# Altium schematic sheet [07] - ETHERNET CONTROLLER.SchDoc
size A3; SheetNumber: 8; SheetTotal: 10
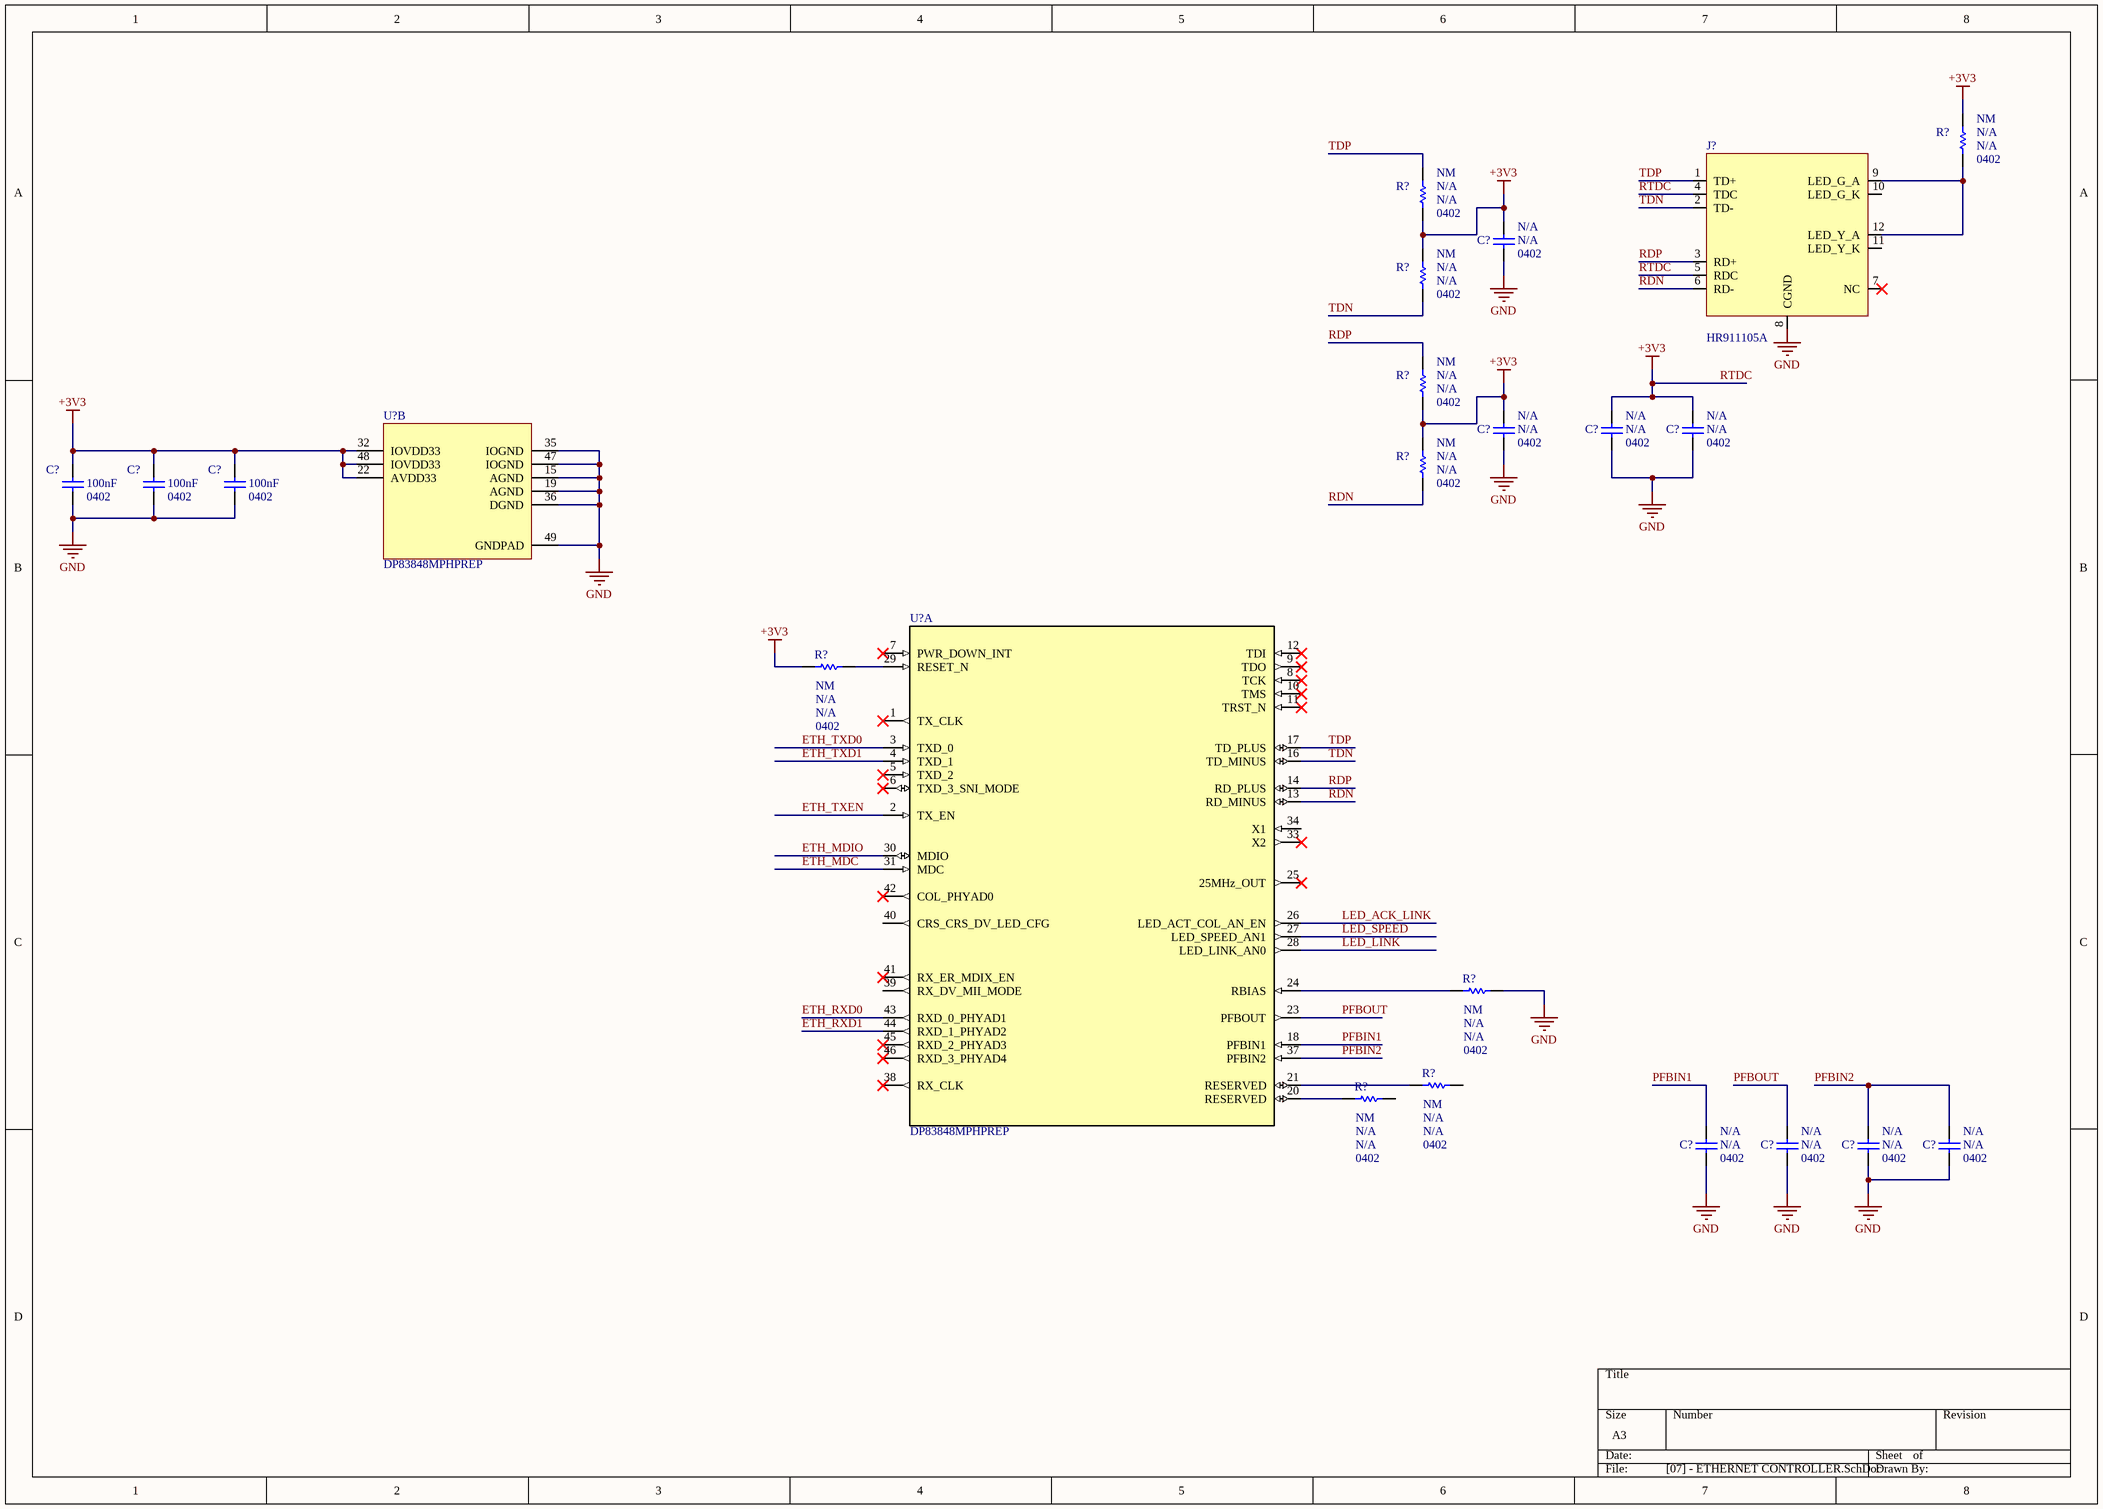
[diagram p0: [07] - ETHERNET CONTROLLER.SchDoc]

## Parts
(Parts that share a designator on the sheet are numbered #1, #2 ... from top to bottom, then left to right.)
C?#1  Package / Case: 0402  [CAP_0402]  (hidden comment: CAP 0402)
C?#2  Package / Case: 0402  [CAP_0402]  (hidden comment: CAP 0402)
C?#3  Package / Case: 0402  [CAP_0402]  (hidden comment: CAP 0402)
C?#4  Package / Case: 0402  [CAP_0402]  (hidden comment: CAP 0402)
C?#5  Package / Case: 0402  Capacitance: 100nF  [CAP_0402]  (hidden comment: CAP 0402)
C?#6  Package / Case: 0402  Capacitance: 100nF  [CAP_0402]  (hidden comment: CAP 0402)
C?#7  Package / Case: 0402  Capacitance: 100nF  [CAP_0402]  (hidden comment: CAP 0402)
C?#8  Package / Case: 0402  [CAP_0402]  (hidden comment: CAP 0402)
C?#9  Package / Case: 0402  [CAP_0402]  (hidden comment: CAP 0402)
C?#10  Package / Case: 0402  [CAP_0402]  (hidden comment: CAP 0402)
C?#11  Package / Case: 0402  [CAP_0402]  (hidden comment: CAP 0402)
J?  HR911105A  [CONN_RJ45_HANRUN_HR911105A]
R?#1  Package / Case: 0402  Resistance: NM  [RES_0402]  (hidden comment: RES 0402)
R?#2  Package / Case: 0402  Resistance: NM  [RES_0402]  (hidden comment: RES 0402)
R?#3  Package / Case: 0402  Resistance: NM  [RES_0402]  (hidden comment: RES 0402)
R?#4  Package / Case: 0402  Resistance: NM  [RES_0402]  (hidden comment: RES 0402)
R?#5  Package / Case: 0402  Resistance: NM  [RES_0402]  (hidden comment: RES 0402)
R?#6  Package / Case: 0402  Resistance: NM  [RES_0402]  (hidden comment: RES 0402)
R?#7  Package / Case: 0402  Resistance: NM  [RES_0402]  (hidden comment: RES 0402)
R?#8  Package / Case: 0402  Resistance: NM  [RES_0402]  (hidden comment: RES 0402)
R?#9  Package / Case: 0402  Resistance: NM  [RES_0402]  (hidden comment: RES 0402)
U?#1  DP83848MPHPREP  [TI_PHY_DP83848-EP]  (part B of 2)
U?#2  DP83848MPHPREP  [TI_PHY_DP83848-EP]  (part A of 2)

## Nets
GND: C?#1.1 C?#2.1 C?#3.1 C?#4.1 C?#5.1 C?#6.1 C?#7.1 C?#8.1 C?#9.1 C?#10.1 C?#11.1 J?.8(CGND) R?#7.1 U?#1.15(AGND) U?#1.19(AGND) U?#1.35(IOGND) U?#1.36(DGND) U?#1.47(IOGND) U?#1.49(GNDPAD)
RTDC: C?#1.2 C?#2.2 C?#3.2 C?#4.2 C?#5.2 C?#6.2 C?#7.2 J?.4(TDC) J?.5(RDC) R?#1.2 R?#2.1 R?#3.2 R?#4.1 R?#5.2 R?#6.2 U?#1.22(AVDD33) U?#1.32(IOVDD33) U?#1.48(IOVDD33)  [also labelled +3V3]
ETH_MDC: U?#2.31(MDC)
ETH_MDIO: U?#2.30(MDIO)
ETH_RXD0: U?#2.43(RXD_0_PHYAD1)
ETH_RXD1: U?#2.44(RXD_1_PHYAD2)
ETH_TXD0: U?#2.3(TXD_0)
ETH_TXD1: U?#2.4(TXD_1)
ETH_TXEN: U?#2.2(TX_EN)
LED_ACK_LINK: U?#2.26(LED_ACT_COL_AN_EN)
LED_LINK: U?#2.28(LED_LINK_AN0)
LED_SPEED: U?#2.27(LED_SPEED_AN1)
PFBIN1: C?#8.2 U?#2.18(PFBIN1)
PFBIN2: C?#10.2 C?#11.2 U?#2.37(PFBIN2)
PFBOUT: C?#9.2 U?#2.23(PFBOUT)
RDN: J?.6(RD-) R?#5.1 U?#2.13(RD_MINUS)
RDP: J?.3(RD+) R?#4.2 U?#2.14(RD_PLUS)
TDN: J?.2(TD-) R?#3.1 U?#2.16(TD_MINUS)
TDP: J?.1(TD+) R?#2.2 U?#2.17(TD_PLUS)
NetJ?_9: J?.9(LED_G_A) J?.12(LED_Y_A) R?#1.1
NetR?#6_1: R?#6.1 U?#2.29(RESET_N)
NetR?#7_2: R?#7.2 U?#2.24(RBIAS)
NetR?#8_2: R?#8.2 U?#2.21(RESERVED)
NetR?#9_2: R?#9.2 U?#2.20(RESERVED)

Not connected (* = marked no-connect by the designer): J? 7(NC)* 10(LED_G_K) 11(LED_Y_K); R?#8 1; R?#9 1; U?#2 1(TX_CLK)* 5(TXD_2)* 6(TXD_3_SNI_MODE)* 7(PWR_DOWN_INT)* 8(TCK)* 9(TDO)* 10(TMS)* 11(TRST_N)* 12(TDI)* 25(25MHz_OUT)* 33(X2)* 34(X1) 38(RX_CLK)* 39(RX_DV_MII_MODE) 40(CRS_CRS_DV_LED_CFG) 41(RX_ER_MDIX_EN)* 42(COL_PHYAD0)* 45(RXD_2_PHYAD3)* 46(RXD_3_PHYAD4)*

## Library data of the parts
C?#1-C?#4 C?#8-C?#11 = CAP_0402_NM: CAP, size 0402, NM, N/A; Supplier URL: N/A; Tolerance: N/A; Supplier: N/A; Supplier Part Number: N/A; ComponentLink1Description: Datasheet; ComponentLink1URL: N/A; Mount: SMD/SMT; Operating Temperature Max: + 85 C; Operating Temperature Min: - 40 C; Packaging: Tape and Reel; Voltage Rating DC: N/A; Capacitance: N/A
C?#5-C?#7 = CAP_0402_NM: CAP, size 0402, NM, N/A; Tolerance: 10%; Voltage Rating DC: 50V; Supplier URL: https://www.thegioiic.com/tu-gom-0402-100nf-0-1uf-50v; Supplier: thegioiic; Supplier Part Number: Tụ Gốm 0402 100nF (0.1uF) 50V; ComponentLink1Description: Datasheet; ComponentLink1URL: N/A; Mount: SMD/SMT; Operating Temperature Max: + 85 C; Operating Temperature Min: - 40 C; Packaging: Tape and Reel
J? = CONN_RJ45-HR911105A: Single Port RJ45 Connector w/ Integrated Magnetic and LED 10/100 Base-T; Manufacturer: HanRun; Manufacturer Part Number: HR911105A
R?#1-R?#9 = RES_0402_NM: RES, size 0402, NM, N/A; Supplier backup URL: N/A; Packaging: Tape and Reel; Supplier: N/A; Supplier Part Number: N/A; Supplier backup: N/A; Supplier backup Part Number: N/A; Manufacturer: N/A; Manufacturer Part Number: N/A; ComponentLink1Description: Datasheet; ComponentLink1URL: N/A; Mount: SMD/SMT; Operating Temperature Max: + 85 C; Operating Temperature Min: - 40 C; LCSC Part #: N/A; Supplier URL: N/A; Tolerance: N/A; Rated Power: N/A
U?#1 U?#2 = IC_DP83848MPHPREP: Enhanced Product PHYTER extreme temperature single port 10/100 Mb/s Ethernet physical layer 48-HTQFP -55 to 125; Manufacturer_Name: Texas Instruments; Alternate_Manufacturer: None; CurrentTime: Not shown in title block; DocumentNumber: 1; SymbolCreator: a0411947; CompType: IC; U/M: EA; Designator: U?; Copyright: Copyright (C) 2025 Ultra Librarian. All rights reserved.; Manufacturer_Part_Number: DP83848MPHPREP; CurrentDate: Not shown in title block; Time: Not shown in title block; Date: Not shown in title block; DocumentFullPathAndName: Not shown in title block; DocumentName: Not shown in title block; ModifiedDate: Not shown in title block; ApprovedBy: Not shown in title block; CheckedBy: Not shown in title block; Author: Not shown in title block; CompanyName: Not shown in title block; Engineer: Not shown in title block; Organization: Not shown in title block; Address1: Not shown in title block; Address2: Not shown in title block; Address3: Not shown in title block; Address4: Not shown in title block; Revision: Use project parameter SCH_Rev; SheetNumber: 1; SheetTotal: 1; ImagePath: Not shown in title block; Rule: *; ProjectName: *; SymbolVersion: 2014-04-03; PartNumber: DP83848MPHPREP; PackageReference: PHP0048F; MountType: SMT; ComponentLink1Description: Datasheet Link; ComponentLink1URL: https://sps06.itg.ti.com/sites/KMS/crossdivteams/altium/docs/ComponentDatasheets/dp83848-ep.pdf; RoHS: Y; Publisher: Texas Instruments; LatestRevisionDate: 2014-04-03; Manufacturer: Texas Instruments; Refdes: Refdes; Type: Type